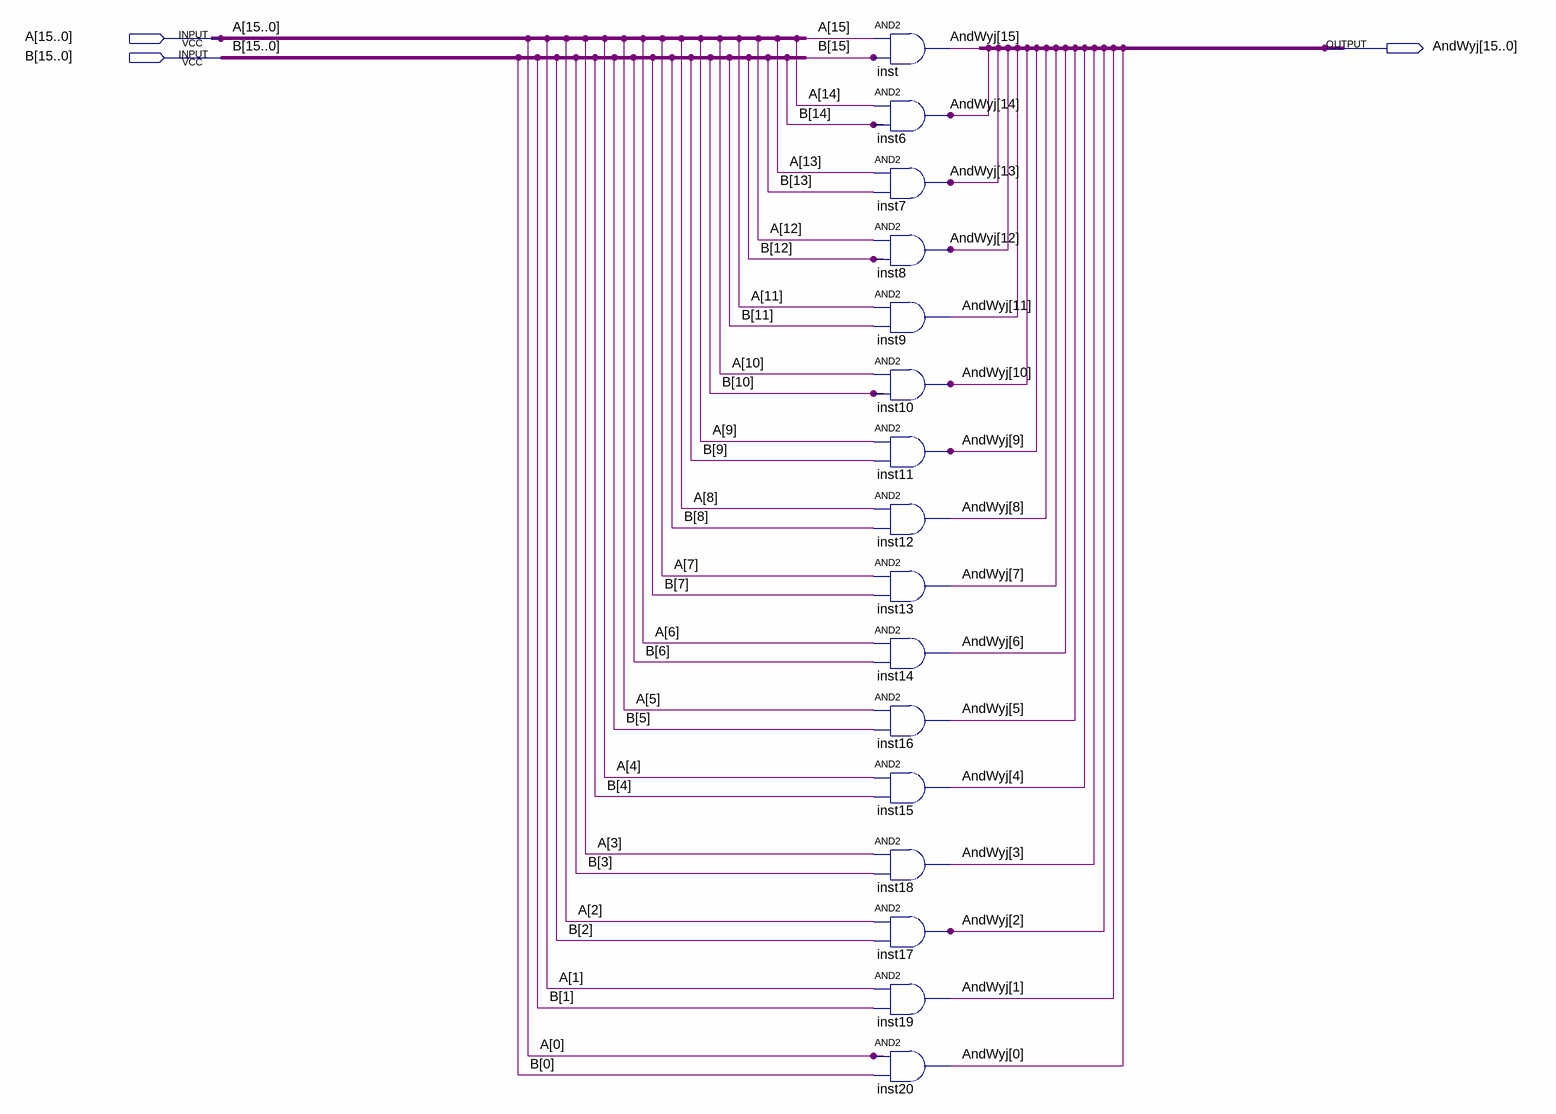
[diagram p0: schematic sheet]
// Quartus schematic andvector.bdf as structural Verilog: 16 symbols, 3 pins
module andvector (
  input  [15:0] A,
  input  [15:0] B,
  output [15:0] AndWyj
);

  and inst (AndWyj[15], A[15], B[15]);
  and inst6 (AndWyj[14], A[14], B[14]);
  and inst7 (AndWyj[13], A[13], B[13]);
  and inst8 (AndWyj[12], A[12], B[12]);
  and inst9 (AndWyj[11], A[11], B[11]);
  and inst10 (AndWyj[10], A[10], B[10]);
  and inst11 (AndWyj[9], A[9], B[9]);
  and inst12 (AndWyj[8], A[8], B[8]);
  and inst13 (AndWyj[7], A[7], B[7]);
  and inst14 (AndWyj[6], A[6], B[6]);
  and inst16 (AndWyj[5], A[5], B[5]);
  and inst15 (AndWyj[4], A[4], B[4]);
  and inst18 (AndWyj[3], A[3], B[3]);
  and inst17 (AndWyj[2], A[2], B[2]);
  and inst19 (AndWyj[1], A[1], B[1]);
  and inst20 (AndWyj[0], A[0], B[0]);
endmodule
